# Altium schematic sheet DigitalClockV2sch.SchDoc
size C; SheetNumber: 1; SheetTotal: 1
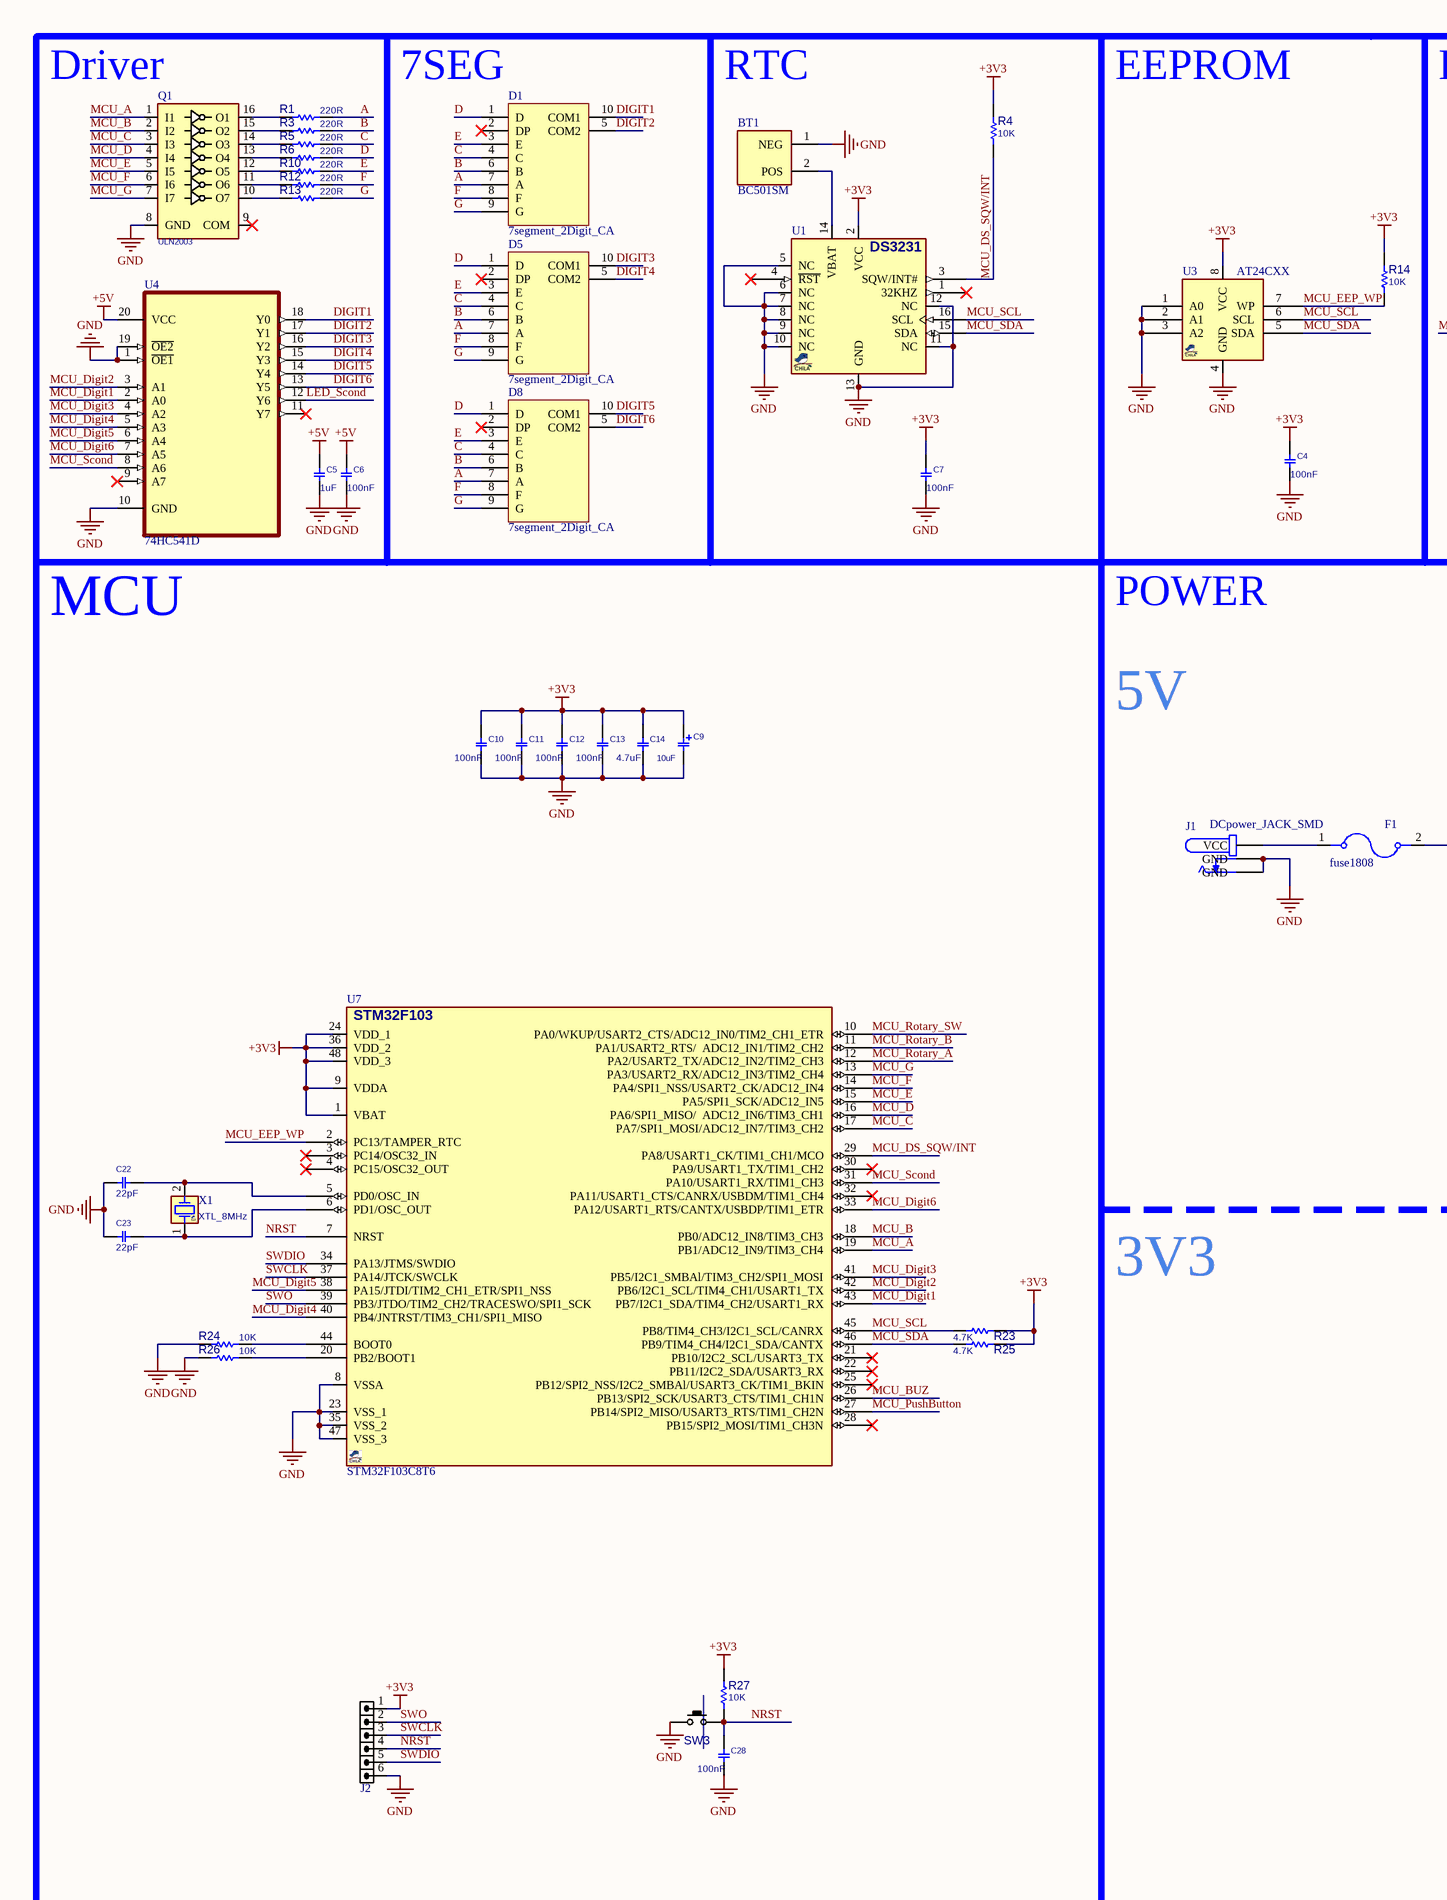
[diagram p0: DigitalClockV2sch.SchDoc, left]
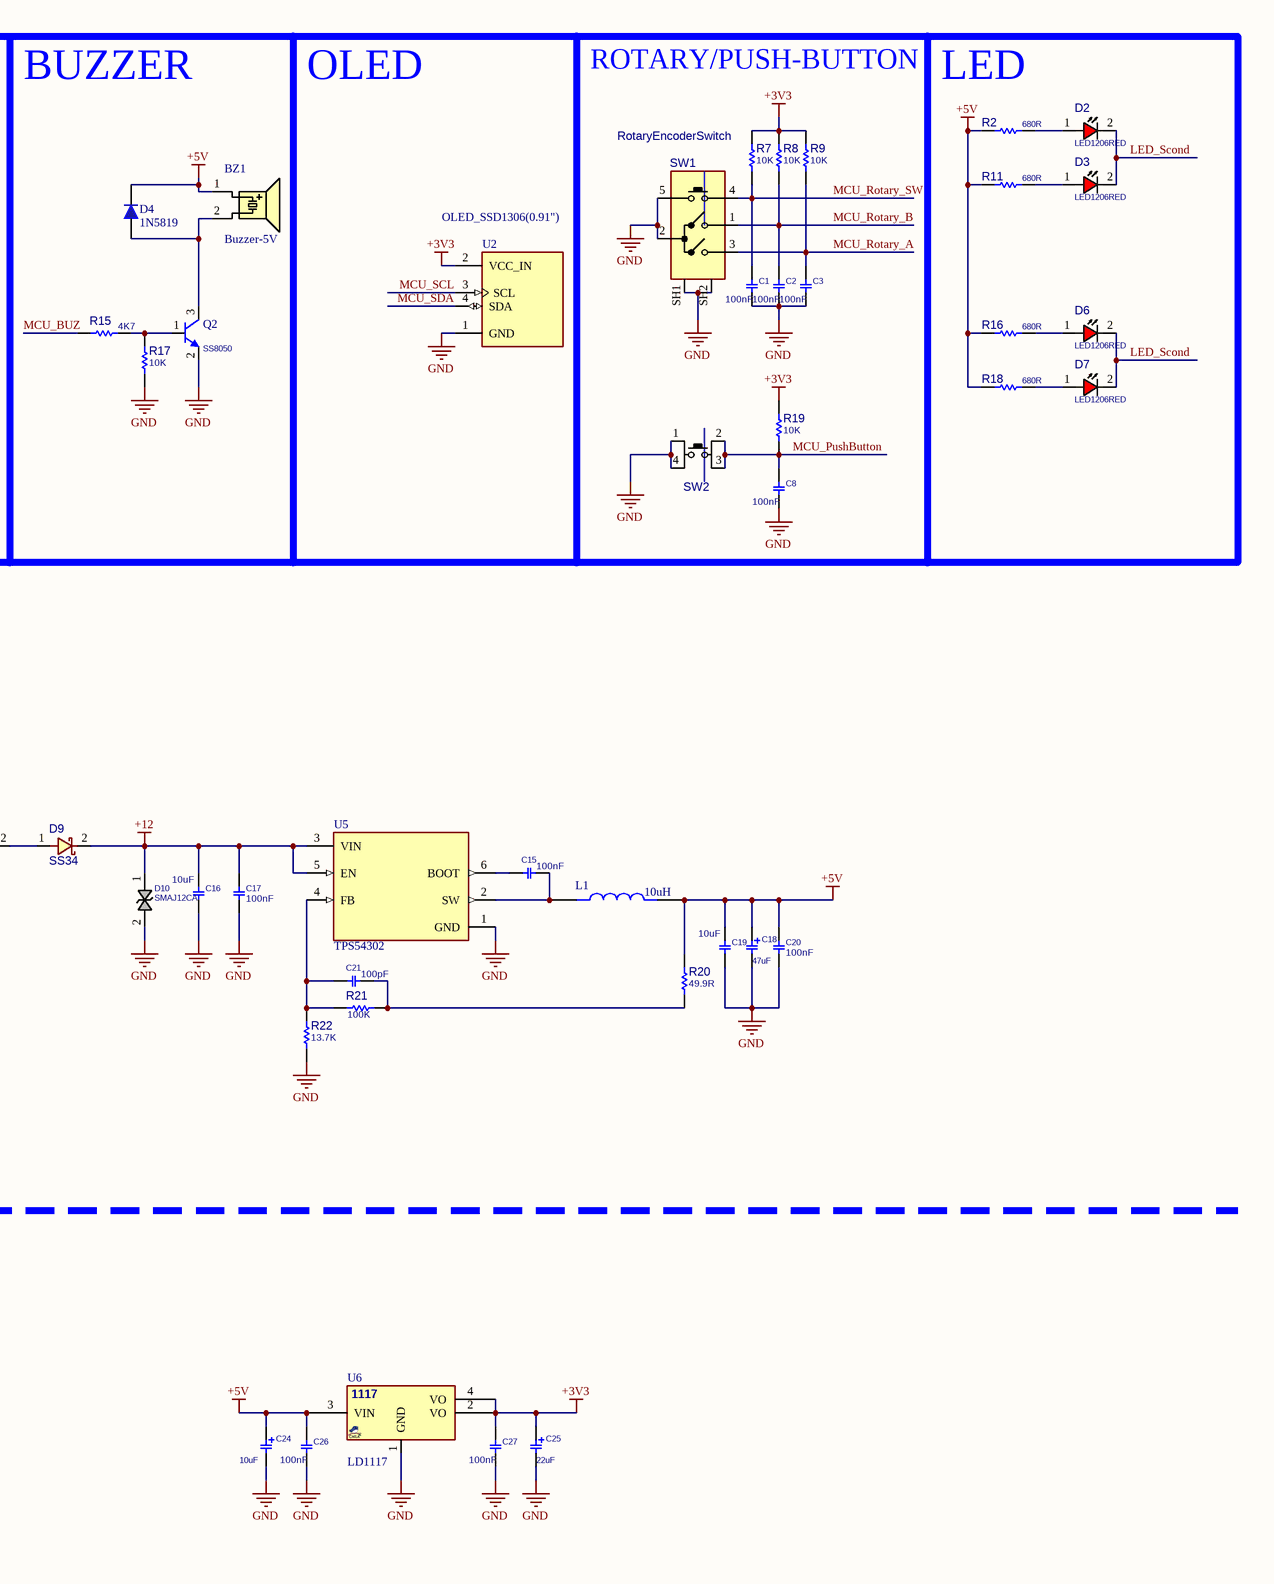
[diagram p1: DigitalClockV2sch.SchDoc, right]

## Parts
BT1  BC501SM  [BC501SM]
BZ1  Buzzer-5V  [Buzzer-9mm]
C1  100nF  [C0603]
C2  100nF  [C0603]
C3  100nF  [C0603]
C4  100nF  [C0805]
C5  1uF  [C0805]
C6  100nF  [C0805]
C7  100nF  [C0805]
C8  100nF  [C0603]
C9  10uF  [C_TN_3216]
C10  100nF  [C0603]
C11  100nF  [C0603]
C12  100nF  [C0603]
C13  100nF  [C0603]
C14  4.7uF  [C0603]
C15  100nF  [C0603]
C16  10uF  [C1206]
C17  100nF  [C1206]
C18  47uF  [C_TN_3216]
C19  10uF  [C1206]
C20  100nF  [C1206]
C21  100pF  [C0603]
C22  22pF  [C0603]
C23  22pF  [C0603]
C24  10uF  [C_TN_3216]
C25  22uF  [C_TN_3216]
C26  100nF  [C0603]
C27  100nF  [C0603]
C28  100nF  [C0603]
D1  7segment_2Digit_CA  [7segment_2Digit_CA]
D2  LED1206RED  [LED1206RED]
D3  LED1206RED  [LED1206RED]
D4  1N5819  [DO-214AC(SMA)]
D5  7segment_2Digit_CA  [7segment_2Digit_CA]
D6  LED1206RED  [LED1206RED]
D7  LED1206RED  [LED1206RED]
D8  7segment_2Digit_CA  [7segment_2Digit_CA]
D9  SS34  [D_SMB]
D10  SMAJ12CA  [D_SMA]
F1  fuse1808  [fuse1808]
J1  DCpower_JACK_SMD  [DCpower_JACK_SMD]
J2  HDR1X6  [HDR_M_1X6]  (value not drawn)
L1  10uH  [TDK SMD inductor 7mm * 7mm]
Q1  ULN2003  [SO_16]
Q2  SS8050  [SOT23_3]
R1  220R  [R0805]
R2  680R  [R1206]
R3  220R  [R0805]
R4  10K  [R0603]
R5  220R  [R0805]
R6  220R  [R0805]
R7  10K  [R0603]
R8  10K  [R0603]
R9  10K  [R0603]
R10  220R  [R0805]
R11  680R  [R1206]
R12  220R  [R0805]
R13  220R  [R0805]
R14  10K  [R0805]
R15  4K7  [R0603]
R16  680R  [R1206]
R17  10K  [R0603]
R18  680R  [R1206]
R19  10K  [R0603]
R20  49.9R  [R0603]
R21  100K  [R0603]
R22  13.7K  [R0805]
R23  4.7K  [R0805]
R24  10K  [R0603]
R25  4.7K  [R0805]
R26  10K  [R0603]
R27  10K  [R0603]
SW1  RotaryEncoderSwitch  [SWROT_11MM]
SW2  PUSHBUTTON  [SWPBT_SPDT_6X6X17SKHH]  (value not drawn)
SW3  PUSHBUTTON  [SWPBS_SPST_6X3X2]  (value not drawn)
U1  DS3231  [SO_16_W]  (value not drawn)
U2  OLED_SSD1306(0.91")  [OLED_Display 0.91" 32*128]
U3  AT24CXX  [SO_8]
U4  74HC541D  [74HC541D]
U5  TPS54302  [TPS54302]
U6  LD1117  [SOT223_4]
U7  STM32F103C8T6  [STM32F103C8T6]
X1  XTL_8MHz  [XTL_2_11X5]

## Blocks framed on the sheet
Driver: C5 C6 Q1 R1 R3 R5 R6 R10 R12 R13 U4

## Nets
+3V3: C4.2 C7.2 C9.1 C10.2 C11.2 C12.2 C13.2 C14.2 C25.1 C27.2 J2.1 R4.2 R7.2 R8.2 R9.2 R14.1 R19.2 R23.2 R25.2 R27.1 U1.2(VCC) U2.2(VCC_IN) U3.8(VCC) U6.2(VO) U6.4(VO) U7.1(VBAT) U7.9(VDDA) U7.24(VDD_1) U7.36(VDD_2) U7.48(VDD_3)
+5V: BZ1.1(A) C5.2 C6.2 C18.1 C19.2 C20.2 C24.1 C26.2 D4.2 L1.2 R2.1 R11.1 R16.1 R18.1 R20.1 U4.20(VCC) U6.3(VIN)
+12: C16.2 C17.2 D9.2 D10.1 U5.3(VIN) U5.5(EN)
GND: BT1.1(NEG) C1.1 C2.1 C3.1 C4.1 C5.1 C6.1 C7.1 C8.1 C9.2 C10.1 C11.1 C12.1 C13.1 C14.1 C16.1 C17.1 C18.2 C19.1 C20.1 C22.2 C23.2 C24.2 C25.2 C26.1 C27.1 C28.1 D10.2 J1.2(GND) J1.3(GND) J2.6 Q1.8(GND) Q2.2(E) R17.1 R22.2 R24.2 R26.2 SW1.2(C) SW1.5(D) SW1.SH1 SW1.SH2 SW2.1(P1) SW2.4(P2) SW3.1(P1) U1.5(NC) U1.6(NC) U1.7(NC) U1.8(NC) U1.9(NC) U1.10(NC) U1.11(NC) U1.12(NC) U1.13(GND) U2.1(GND) U3.1(A0) U3.2(A1) U3.3(A2) U3.4(GND) U4.1(~{OE1}) U4.10(GND) U4.19(~{OE2}) U5.1(GND) U6.1(GND) U7.8(VSSA) U7.23(VSS_1) U7.35(VSS_2) U7.47(VSS_3)
A: D1.7(A) D5.7(A) D8.7(A) R1.2
B: D1.6(B) D5.6(B) D8.6(B) R3.2
C: D1.4(C) D5.4(C) D8.4(C) R5.2
D: D1.1(D) D5.1(D) D8.1(D) R6.2
DIGIT1: D1.10(COM1) U4.18(Y0)
DIGIT2: D1.5(COM2) U4.17(Y1)
DIGIT3: D5.10(COM1) U4.16(Y2)
DIGIT4: D5.5(COM2) U4.15(Y3)
DIGIT5: D8.10(COM1) U4.14(Y4)
DIGIT6: D8.5(COM2) U4.13(Y5)
E: D1.3(E) D5.3(E) D8.3(E) R10.2
F: D1.8(F) D5.8(F) D8.8(F) R12.2
G: D1.9(G) D5.9(G) D8.9(G) R13.2
LED_Scond: D2.2(CATHODE) D3.2(CATHODE) D6.2(CATHODE) D7.2(CATHODE) U4.12(Y6)
MCU_A: Q1.1(I1) U7.19(PB1/ADC12_IN9/TIM3_CH4)
MCU_B: Q1.2(I2) U7.18(PB0/ADC12_IN8/TIM3_CH3)
MCU_BUZ: R15.1 U7.26(PB13/SPI2_SCK/USART3_CTS/TIM1_CH1N)
MCU_C: Q1.3(I3) U7.17(PA7/SPI1_MOSI/ADC12_IN7/TIM3_CH2)
MCU_D: Q1.4(I4) U7.16(PA6/SPI1_MISO/__ADC12_IN6/TIM3_CH1)
MCU_Digit1: U4.2(A0) U7.43(PB7/I2C1_SDA/TIM4_CH2/USART1_RX)
MCU_Digit2: U4.3(A1) U7.42(PB6/I2C1_SCL/TIM4_CH1/USART1_TX)
MCU_Digit3: U4.4(A2) U7.41(PB5/I2C1_SMBAl/TIM3_CH2/SPI1_MOSI)
MCU_Digit4: U4.5(A3) U7.40(PB4/JNTRST/TIM3_CH1/SPI1_MISO)
MCU_Digit5: U4.6(A4) U7.38(PA15/JTDI/TIM2_CH1_ETR/SPI1_NSS)
MCU_Digit6: U4.7(A5) U7.33(PA12/USART1_RTS/CANTX/USBDP/TIM1_ETR)
MCU_DS_SQW/INT: R4.1 U1.3(SQW/INT#) U7.29(PA8/USART1_CK/TIM1_CH1/MCO)
MCU_E: Q1.5(I5) U7.15(PA5/SPI1_SCK/ADC12_IN5)
MCU_EEP_WP: R14.2 U3.7(WP) U7.2(PC13/TAMPER_RTC)
MCU_F: Q1.6(I6) U7.14(PA4/SPI1_NSS/USART2_CK/ADC12_IN4)
MCU_G: Q1.7(I7) U7.13(PA3/USART2_RX/ADC12_IN3/TIM2_CH4)
MCU_PushButton: C8.2 R19.1 SW2.2(P3) SW2.3(P4) U7.27(PB14/SPI2_MISO/USART3_RTS/TIM1_CH2N)
MCU_Rotary_A: C3.2 R9.1 SW1.3(B) U7.12(PA2/USART2_TX/ADC12_IN2/TIM2_CH3)
MCU_Rotary_B: C2.2 R8.1 SW1.1(A) U7.11(PA1/USART2_RTS/__ADC12_IN1/TIM2_CH2)
MCU_Rotary_SW: C1.2 R7.1 SW1.4(E) U7.10(PA0/WKUP/USART2_CTS/ADC12_IN0/TIM2_CH1_ETR)
MCU_SCL: R23.1 U1.16(SCL) U2.3(SCL) U3.6(SCL) U7.45(PB8/TIM4_CH3/I2C1_SCL/CANRX)
MCU_Scond: U4.8(A6) U7.31(PA10/USART1_RX/TIM1_CH3)
MCU_SDA: R25.1 U1.15(SDA) U2.4(SDA) U3.5(SDA) U7.46(PB9/TIM4_CH4/I2C1_SDA/CANTX)
NRST: C28.2 J2.4 R27.2 SW3.2(P3) U7.7(NRST)
SWCLK: J2.3 U7.37(PA14/JTCK/SWCLK)
SWDIO: J2.5 U7.34(PA13/JTMS/SWDIO)
SWO: J2.2 U7.39(PB3/JTDO/TIM2_CH2/TRACESWO/SPI1_SCK)
NetBT1_2: BT1.2(POS) U1.14(VBAT)
NetBZ1_2: BZ1.2(B) D4.1 Q2.3(C)
NetC15_1: C15.1 L1.1 U5.2(SW)
NetC15_2: C15.2 U5.6(BOOT)
NetC21_1: C21.1 R20.2 R21.1
NetC21_2: C21.2 R21.2 R22.1 U5.4(FB)
NetC22_1: C22.1 U7.5(PD0/OSC_IN) X1.2(OSC2)
NetC23_1: C23.1 U7.6(PD1/OSC_OUT) X1.1(OSC1)
NetD2_1: D2.1(ANODE) R2.2
NetD3_1: D3.1(ANODE) R11.2
NetD6_1: D6.1(ANODE) R16.2
NetD7_1: D7.1(ANODE) R18.2
NetD9_1: D9.1 F1.2
NetF1_1: F1.1 J1.1(VCC)
NetQ1_10: Q1.10(O7) R13.1
NetQ1_11: Q1.11(O6) R12.1
NetQ1_12: Q1.12(O5) R10.1
NetQ1_13: Q1.13(O4) R6.1
NetQ1_14: Q1.14(O3) R5.1
NetQ1_15: Q1.15(O2) R3.1
NetQ1_16: Q1.16(O1) R1.1
NetQ2_1: Q2.1(B) R15.2 R17.2
NetR24_1: R24.1 U7.44(BOOT0)
NetR26_1: R26.1 U7.20(PB2/BOOT1)

Not connected (* = marked no-connect by the designer): D1 2(DP)*; D5 2(DP)*; D8 2(DP)*; Q1 9(COM)*; U1 1(32KHZ)* 4(~{RST})*; U4 9(A7)* 11(Y7)*; U7 3(PC14/OSC32_IN)* 4(PC15/OSC32_OUT)* 21(PB10/I2C2_SCL/USART3_TX)* 22(PB11/I2C2_SDA/USART3_RX)* 25(PB12/SPI2_NSS/I2C2_SMBAl/USART3_CK/TIM1_BKIN)* 28(PB15/SPI2_MOSI/TIM1_CH3N)* 30(PA9/USART1_TX/TIM1_CH2)* 32(PA11/USART1_CTS/CANRX/USBDM/TIM1_CH4)*

## Notes on the sheet
- (near D1) 7SEG
- RTC
- EEPROM
- BUZZER
- OLED
- ROTARY/PUSH-BUTTON
- (near R2) LED
- MCU
- POWER
- 5V
- 3V3
- (in symbol STM32F103C8T6) STM32F103
- (in symbol VREG_1117_SOT223) 1117

## Library data of the parts
BZ1 = Buzzer-9mm: Buzzer 5V 9mm (between pins 5.5mm)
C1-C3 C8 C10-C15 C21-C23 C26-C28 = CAP_SMD_MLCC_0603: CAP, MLCC; PARAM: -, -%; MANF_P#: MANF_PART#; PARAM2: -V; PRICE: 100= 1$; MANF: -; ASSEMBLY: ASSEMBLY
C4-C7 = CAP_SMD_MLCC_0805: CAP, MLCC; PARAM: -, -%; MANF_P#: MANF_PART#; PARAM2: -V; PRICE: 100= 1$; MANF: -; ASSEMBLY: ASSEMBLY
C9 C18 C24 C25 = CAP_SMD_TAN_10uF_10V: CAP, SMD, TAN; PARAM: 20%, 300mOhm, -55~105oC; MANF: VISHAY; MANF_P#: T55A106M010C0300; PARAM2: 10V; PRICE: 0.46$
C16 C17 C19 C20 = CAP_SMD_MLCC_1206: CAP, MLCC; PARAM: -, -%; MANF_P#: MANF_PART#; PARAM2: -V; PRICE: 100= 1$; MANF: -; ASSEMBLY: ASSEMBLY
D1 D5 D8 = 7segment_2Digit_CA: 7segment_2Digit_CA (4021BS) 20.1 * 16
D2 D3 D6 D7 = LED_SMD_1206_RED: LED, SMD, 1206, RED; DESC: DESCRIPTION; MANF_P#: MANF_PART#; PARAM2: 2.2V; MANF: MANF; ASSEMBLY: ASSEMBLY; PRICE: 36t@Javan; VALUE: LED1206RED
D4 = 1N5819(SS14)
D9 = DIODE_SMD_SCHOTTKY_SS34: DIODE, SCHOTTKY, 20V, 3A; MANF: VISHAY; DESC: DESCRIPTION; MANF_P#: SS34; ASSEMBLY: ASSEMBLY; PRICE: PRICE; PARAM2: 3A; PARAM: 20V; VALUE: SS34
D10 = TVS_SMAJ12CA: TVS, ESD PROTECT, Bidirectional; MANF: Littelfuse; PARAM2: 12VR, 13.3VBR; PARAM: -65~150°C; MANF_P#: SMAJ12CA; VALUE: SMAJ12CA
J1 = DCpower_JACK_SMD: Connector, dc jack 5.5x2.5 mm, PCB mount, 90 degrees, silver plated, PA9T, SMT
J2 = HDR_M_1X6: CONN, HEADER, Male, pitch: 2.54mm, 6POS; VALUE: HDRM6
L1 = TDK SMD inductor 7mm * 7mm: 10 ÂµH Shielded Drum Core, Wirewound Inductor 1.78 A 43.2mOhm Max Nonstandard
Q1 = ULN2003_SOP16_ST: Darlington, 7-CH, 50V, 0.5A, 5V TTL/CMOS; MANF_P#: ULN2003D1; MANF: ST; PARAM: 7-CH, 50V, 0.5A; PARAM2: 5V TTL/CMOS; VALUE: ULN2003
Q2 = NPN_SS8050_SOT23: BJT, NPN, 25v, 1.5A, SMD, SOT23; PARAM2: 300mW; MANF: GALAXY; PARAM: 25v, 1.5A; MANF_P#: SS8050; VALUE: SS8050
R1 R3 R5 R6 R10 R12-R14 R22 R23 R25 = RES_SMD_0805: RESISTOR, SMD; PARAM: -W; DESC: DESCRIPTION; DIST#: MOUSER; PARAM2: 1%; MANF_P#: -; MANF: -; ASSEMBLY: ASSEMBLY; PRICE: 100= 0.5$
R2 R11 R16 R18 = RES_SMD_1206: RESISTOR, SMD; PARAM: -W; DESC: DESCRIPTION; DIST#: MOUSER; PARAM2: 1%; MANF_P#: -; MANF: -; ASSEMBLY: ASSEMBLY; PRICE: 100= 0.5$
R4 R7-R9 R15 R17 R19-R21 R24 R26 R27 = RES_SMD_0603: RESISTOR, SMD; PARAM: 1%, 0.1W; DESC: DESCRIPTION; DIST#: MOUSER; MANF_P#: -; MANF: -; ASSEMBLY: ASSEMBLY; PRICE: -; PARAM2: -
SW1 = SWROT_11MM: SWITCH, ROTARY Encoder, 11mm Metal Shaft; MANF_PART#: RE111F-41B3N-15F-20P; MANF: Alpha; DESC: DESCRIPTION; ASSEMBLY: ASSEMBLY; PARAM: PARAM; PRICE: -; VALUE: RotaryEncoderSwitch
SW2 = SWPBT_SPDT_6X6X17_SKHHDHA010: SWITCH, PUSH BUTTON, TACTILE, THD, SPDT, 6X6X17mm; MANF: ALPS; DESC: DESCRIPTION; VALUE: PUSHBUTTON; ASSEMBLY: ASSEMBLY; PARAM: PARAM; PRICE: PRICE; MANF_P#: SKHHDHA010
SW3 = SWPBS_SPST_6X3X2_RS282: SWITCH, PUSH BUTTON, TACTILE, SMD, SPST, 6X3.5X2.5mm; MANF: C&K; DESC: DESCRIPTION; MANF_P#: RS-282G05A3-SM RT; VALUE: PUSHBUTTON; ASSEMBLY: ASSEMBLY; PARAM: PARAM; PRICE: 0.8$
U1 = DS3231_SOP16W: Real-Time Clock, I2C, +IntCryst; MANF: Maxim Integrated; MANF_P#: DS3231SN#; PARAM2: 2.3~5.5V; PARAM: I2C, +IntCryst, -40~85°C; VALUE: DS3231; PRICE: 10$
U2 = OLED_Display 0.91" 32*128
U3 = EEPROM_I2C_AT24CXX_SOP8: EEPROM, I2C,; Value: AT24CXX
U4 = 74HC541D: Buffer, Non-Inverting 1 Element 8 Bit per Element 3-State Output 20-SOIC
U5 = TPS54302: 4.5-V to 28-V Input, 3-A Output, EMI Friendly / Synchronous Step-Down Converter
U6 = VREG_1117_SOT223: REG, Linear, LDO1V, 0.8A, SOT-223; MANF_P#: LD1117, LM1117, AMS1117, TLV1117, REG1117, NCP1117, LT1117, SPX1117; MANF: TI, ON, ST; PARAM2: 1.2/1.5/1.8/2.5/2.85/3.3/5V; PARAM: LDO1V, 0.8A; VALUE: LD1117
U7 = STM32F103C8T6: MCU, STM32 ARM 32-bit, Cortex M3, 64KB FLASH, 20KB SRAM
X1 = XTL_2_HC49_8MHz_SMD: Crystal MOST POPULAR ABL HC49 PACKAGE; MANF: ABRACON; MANF_P#: ABLS-8.000MHZ-B4-T; PARAM: 8MHz, 18pF, 30PPM, -20~70oC; PRICE: 0.3$; VALUE: XTL_8MHz